# Altium schematic sheet mcu0_to_mcu1_isolated_SPI.SchDoc: foxBMS BMS-Master
size A3; DocumentNumber: 12; SheetNumber: 12; SheetTotal: 24; Author: Fraunhofer IISB foxBMS Team; REL-DATE: 2017-05-16; VERSION: 1.0.2; SheetDescription: Isolated Bidirectional Interface MCU0/MCU1
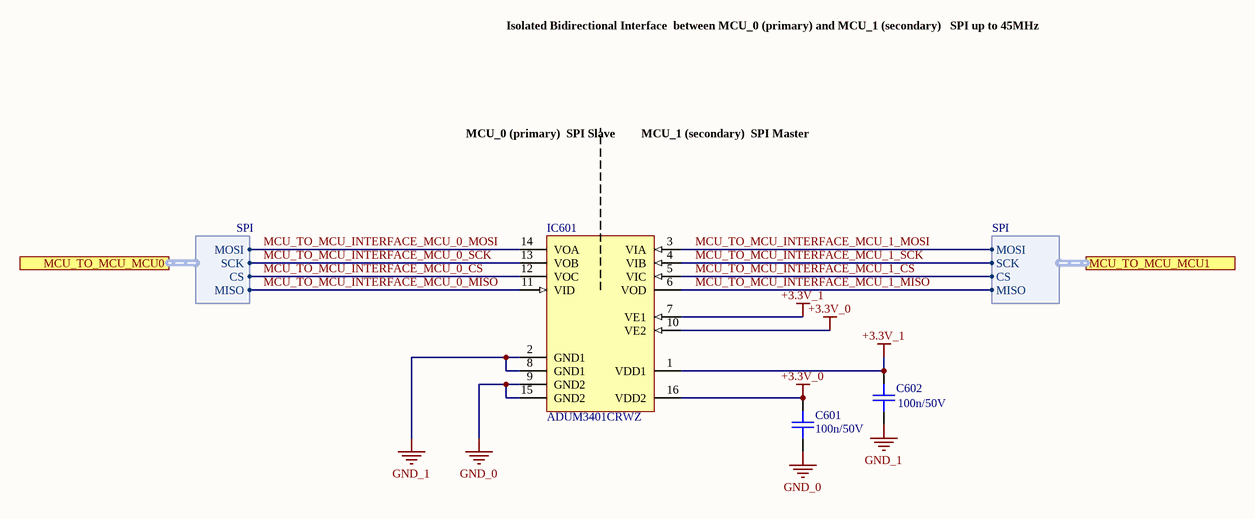
[diagram p0: mcu0_to_mcu1_isolated_SPI.SchDoc]

## Parts
C601  100n/50V  [CAPC1608X08N]
C602  100n/50V  [CAPC1608X08N]
IC601  ADUM3401CRWZ  [ADI-RW-16_N]

## Ports
MCU_TO_MCU_MCU0 (harness SPI), MCU_TO_MCU_MCU1 (harness SPI)

## Harnesses
SPI: CS, MISO, MOSI, SCK

## Nets
+3.3V_0: C601.2 IC601.10(VE2) IC601.16(VDD2)
+3.3V_1: C602.1 IC601.1(VDD1) IC601.7(VE1)
GND_0: C601.1 IC601.9(GND2) IC601.15(GND2)
GND_1: C602.2 IC601.2(GND1) IC601.8(GND1)
MCU_TO_MCU_INTERFACE_MCU_0_CS: IC601.12(VOC) ; port MCU_TO_MCU_MCU0.CS
MCU_TO_MCU_INTERFACE_MCU_0_MISO: IC601.11(VID) ; port MCU_TO_MCU_MCU0.MISO
MCU_TO_MCU_INTERFACE_MCU_0_MOSI: IC601.14(VOA) ; port MCU_TO_MCU_MCU0.MOSI
MCU_TO_MCU_INTERFACE_MCU_0_SCK: IC601.13(VOB) ; port MCU_TO_MCU_MCU0.SCK
MCU_TO_MCU_INTERFACE_MCU_1_CS: IC601.5(VIC) ; port MCU_TO_MCU_MCU1.CS
MCU_TO_MCU_INTERFACE_MCU_1_MISO: IC601.6(VOD) ; port MCU_TO_MCU_MCU1.MISO
MCU_TO_MCU_INTERFACE_MCU_1_MOSI: IC601.3(VIA) ; port MCU_TO_MCU_MCU1.MOSI
MCU_TO_MCU_INTERFACE_MCU_1_SCK: IC601.4(VIB) ; port MCU_TO_MCU_MCU1.SCK

## Notes on the sheet
- Isolated Bidirectional Interface
  between MCU_0 (primary) and MCU_1 (secondary)
  SPI up to 45MHz
- MCU_0 (primary)
  SPI Slave
- MCU_1 (secondary)
  SPI Master
- Fraunhofer IISB
- Schottkystr. 10
- developed by:
- 91058 Erlangen
- Germany
- Author
- Project
- License
- Description
- File
- Version
- Release Date
- Sheet
- www.foxbms.org
- www.iisb.fraunhofer.de
- foxBMS Team
- /

## Library data of the parts
C601 C602 = gen_C_ceramic_100n_50V_X7R_0603: MLCC; Capacitance: 100n; Rated Voltage: 50V; Dielectric: X7R; Case EIA: 0603; Case Metric: 1608; PnP Package: C_0603_10; PnP Value: 100n/50V/X7R; PnP equipped: x; Automotive Qualified: False; Part Number: gen_C_ceramic_100n_50V_X7R_0603; Supplier 1: Farnell; Supplier Part Number 1: 2525267; Supplier 2: Digikey; Supplier Part Number 2: 490-6049-1-ND
IC601 = CMP-0534-00405-1: Quad Channel Digital Isolator, Enhanced System-Level ESD Reliability, 2.5 KV rms Insulation Rating, 90 Mbps Data Rate, 32 ns Delay, Industrial, 16-pin SOIC (RW-16), Tube; Manufacturer: Analog Devices; Insulation Rating (kVrms): 2.5; Max Data Rate: 90Mbps; PackageDescription: 16-Pin Standard Small Outline Package, Body 10.3 x 7.5 mm, Pitch 1.27 mm; ComponentLink2Description: Datasheet; Mounting Technology: Surface Mount; ComponentLink2URL: http://www.analog.com/static/imported-files/data_sheets/ADUM3400_3401_3402.pdf; ComponentLink4URL: Product URL:http://www.analog.com/en/interface-isolation/digital-isolators/adum3401/products/product.html; ComponentLink1URL: http://www.analog.com/en/index.html; ComponentLink1Description: Manufacturer URL; Max Operating Temp (degreesC): 105; PartNumber: ADUM3401CRWZ; Code_JEDEC: MS-013-AA; PackageVersion: 032707-B, 03/2007; ComponentLink3URL: http://www.analog.com/static/imported-files/packages/PKG_PDF/SOIC_WIDE%20%28RW%29/RW_16.pdf; DatasheetVersion: Rev. B; PackageReference: RW-16; ComponentLink4Description: URL Link1; ComponentLink3Description: Package Specification